# Altium schematic sheet 4_viper_eagle_rep-periferals.SchDoc: =ProjectTitle
size A4; Address1: github.com/4pplet/eagle_viper; Address2: Licence: CERN-OHL-S; Address4: www.4pplet.com; SheetNumber: 4; SheetTotal: 5
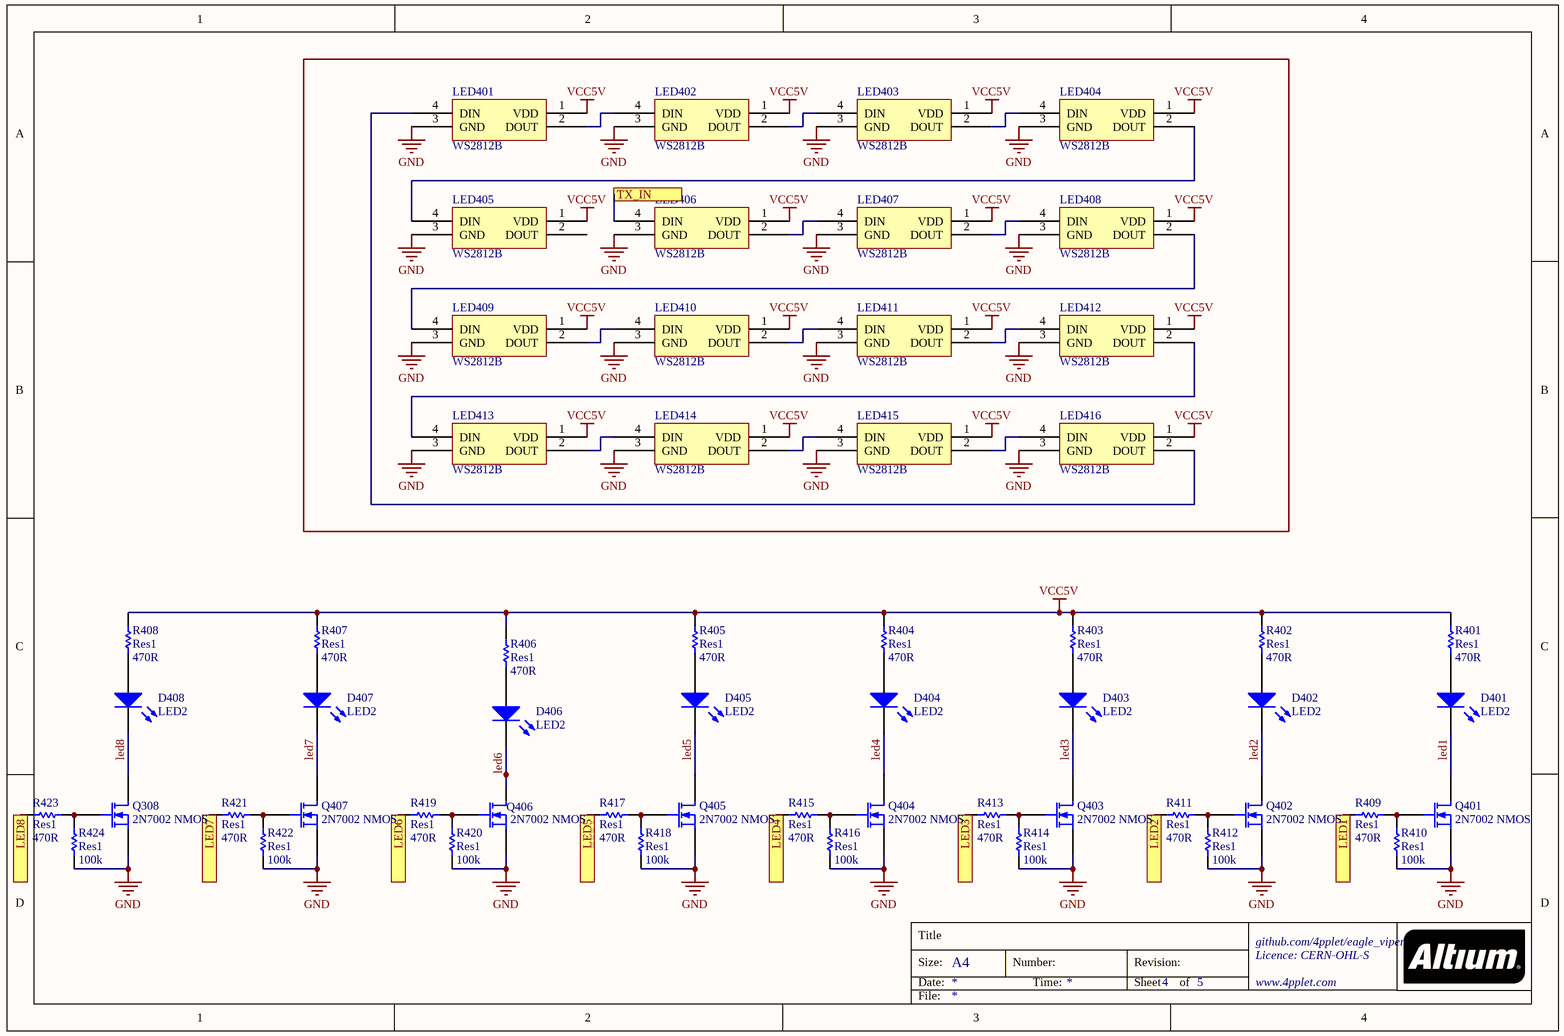
[diagram p0: 4_viper_eagle_rep-periferals.SchDoc]

## Parts
D401  LED2  [LED - THT]
D402  LED2  [LED - THT]
D403  LED2  [LED - THT]
D404  LED2  [LED - THT]
D405  LED2  [LED - THT]
D406  LED2  [LED - THT]
D407  LED2  [LED - THT]
D408  LED2  [LED - THT]
LED401  WS2812B  [WS2812B]
LED402  WS2812B  [WS2812B]
LED403  WS2812B  [WS2812B]
LED404  WS2812B  [WS2812B]
LED405  WS2812B  [WS2812B]
LED406  WS2812B  [WS2812B]
LED407  WS2812B  [WS2812B]
LED408  WS2812B  [WS2812B]
LED409  WS2812B  [WS2812B]
LED410  WS2812B  [WS2812B]
LED411  WS2812B  [WS2812B]
LED412  WS2812B  [WS2812B]
LED413  WS2812B  [WS2812B]
LED414  WS2812B  [WS2812B]
LED415  WS2812B  [WS2812B]
LED416  WS2812B  [WS2812B]
Q308  2N7002 NMOS  [SOT-23-3]
Q401  2N7002 NMOS  [SOT-23-3]
Q402  2N7002 NMOS  [SOT-23-3]
Q403  2N7002 NMOS  [SOT-23-3]
Q404  2N7002 NMOS  [SOT-23-3]
Q405  2N7002 NMOS  [SOT-23-3]
Q406  2N7002 NMOS  [SOT-23-3]
Q407  2N7002 NMOS  [SOT-23-3]
R401  Res1  value 470R  [R0603[1608]]
R402  Res1  value 470R  [R0603[1608]]
R403  Res1  value 470R  [R0603[1608]]
R404  Res1  value 470R  [R0603[1608]]
R405  Res1  value 470R  [R0603[1608]]
R406  Res1  value 470R  [R0603[1608]]
R407  Res1  value 470R  [R0603[1608]]
R408  Res1  value 470R  [R0603[1608]]
R409  Res1  value 470R  [R0603[1608]]
R410  Res1  value 100k  [R0603[1608]]
R411  Res1  value 470R  [R0603[1608]]
R412  Res1  value 100k  [R0603[1608]]
R413  Res1  value 470R  [R0603[1608]]
R414  Res1  value 100k  [R0603[1608]]
R415  Res1  value 470R  [R0603[1608]]
R416  Res1  value 100k  [R0603[1608]]
R417  Res1  value 470R  [R0603[1608]]
R418  Res1  value 100k  [R0603[1608]]
R419  Res1  value 470R  [R0603[1608]]
R420  Res1  value 100k  [R0603[1608]]
R421  Res1  value 470R  [R0603[1608]]
R422  Res1  value 100k  [R0603[1608]]
R423  Res1  value 470R  [R0603[1608]]
R424  Res1  value 100k  [R0603[1608]]

## Ports
LED1, LED2, LED3, LED4, LED5, LED6, LED7, LED8, TX_IN

## Nets
GND: LED401.3(GND) LED402.3(GND) LED403.3(GND) LED404.3(GND) LED405.3(GND) LED406.3(GND) LED407.3(GND) LED408.3(GND) LED409.3(GND) LED410.3(GND) LED411.3(GND) LED412.3(GND) LED413.3(GND) LED414.3(GND) LED415.3(GND) LED416.3(GND) Q308.2(S) Q401.2(S) Q402.2(S) Q403.2(S) Q404.2(S) Q405.2(S) Q406.2(S) Q407.2(S) R410.2 R412.2 R414.2 R416.2 R418.2 R420.2 R422.2 R424.2
VCC5V: LED401.1(VDD) LED402.1(VDD) LED403.1(VDD) LED404.1(VDD) LED405.1(VDD) LED406.1(VDD) LED407.1(VDD) LED408.1(VDD) LED409.1(VDD) LED410.1(VDD) LED411.1(VDD) LED412.1(VDD) LED413.1(VDD) LED414.1(VDD) LED415.1(VDD) LED416.1(VDD) R401.1 R402.1 R403.1 R404.1 R405.1 R406.1 R407.1 R408.1
led1: D401.2(K) Q401.3(D)
LED1: R409.1 ; port LED1  [a separate net that carries the same name]
led2: D402.2(K) Q402.3(D)
LED2: R411.1 ; port LED2  [a separate net that carries the same name]
led3: D403.2(K) Q403.3(D)
LED3: R413.1 ; port LED3  [a separate net that carries the same name]
led4: D404.2(K) Q404.3(D)
LED4: R415.1 ; port LED4  [a separate net that carries the same name]
led5: D405.2(K) Q405.3(D)
LED5: R417.1 ; port LED5  [a separate net that carries the same name]
led6: D406.2(K) Q406.3(D)
LED6: R419.1 ; port LED6  [a separate net that carries the same name]
led7: D407.2(K) Q407.3(D)
LED7: R421.1 ; port LED7  [a separate net that carries the same name]
led8: D408.2(K) Q308.3(D)
LED8: R423.1 ; port LED8  [a separate net that carries the same name]
TX_IN: LED406.4(DIN) ; port TX_IN
NetD401_1: D401.1(A) R401.2
NetD402_1: D402.1(A) R402.2
NetD403_1: D403.1(A) R403.2
NetD404_1: D404.1(A) R404.2
NetD405_1: D405.1(A) R405.2
NetD406_1: D406.1(A) R406.2
NetD407_1: D407.1(A) R407.2
NetD408_1: D408.1(A) R408.2
NetLED401_2: LED401.2(DOUT) LED402.4(DIN)
NetLED401_4: LED401.4(DIN) LED416.2(DOUT)
NetLED402_2: LED402.2(DOUT) LED403.4(DIN)
NetLED403_2: LED403.2(DOUT) LED404.4(DIN)
NetLED404_2: LED404.2(DOUT) LED405.4(DIN)
NetLED406_2: LED406.2(DOUT) LED407.4(DIN)
NetLED407_2: LED407.2(DOUT) LED408.4(DIN)
NetLED408_2: LED408.2(DOUT) LED409.4(DIN)
NetLED409_2: LED409.2(DOUT) LED410.4(DIN)
NetLED410_2: LED410.2(DOUT) LED411.4(DIN)
NetLED411_2: LED411.2(DOUT) LED412.4(DIN)
NetLED412_2: LED412.2(DOUT) LED413.4(DIN)
NetLED413_2: LED413.2(DOUT) LED414.4(DIN)
NetLED414_2: LED414.2(DOUT) LED415.4(DIN)
NetLED415_2: LED415.2(DOUT) LED416.4(DIN)
NetQ308_1: Q308.1(G) R423.2 R424.1
NetQ401_1: Q401.1(G) R409.2 R410.1
NetQ402_1: Q402.1(G) R411.2 R412.1
NetQ403_1: Q403.1(G) R413.2 R414.1
NetQ404_1: Q404.1(G) R415.2 R416.1
NetQ405_1: Q405.1(G) R417.2 R418.1
NetQ406_1: Q406.1(G) R419.2 R420.1
NetQ407_1: Q407.1(G) R421.2 R422.1

Not connected (* = marked no-connect by the designer): LED405 2(DOUT)

## Notes on the sheet
- Title
- Size:
- Date:
- A4
- Number:
- Time:
- Revision:
- Sheet
- of
- File:

## Library data of the parts
D401-D408 = LED2: Typical RED, GREEN, YELLOW, AMBER GaAs LED
LED401-LED416 = WS2812B: MRF.Part: WS2812B-V5/W; LCSC MFG: Worldsemi; LCSC Part #: C2874885
Q308 Q401-Q407 = MOSFET-N: N-Channel MOSFET; LCSC MFG: Changjiang Electronics Tech (CJ); LCSC Part #: C8545; MRF.Part: 2N7002
R401-R409 R411 R413 R415 R417 R419 R421 R423 = Res1: Resistor; MRF.Part: 0603WAF4700T5E; LCSC MFG: Uniroyal Elec; Version: 0603 imperial; LCSC Part #: C23179
R410 R412 R414 R416 R418 R420 R422 R424 = Res1: Resistor; MRF.Part: 0603WAF1003T5E; LCSC MFG: Uniroyal Elec; Version: 0603 imperial; LCSC Part #: C25803